# Altium schematic sheet main.SCHDOC
size B
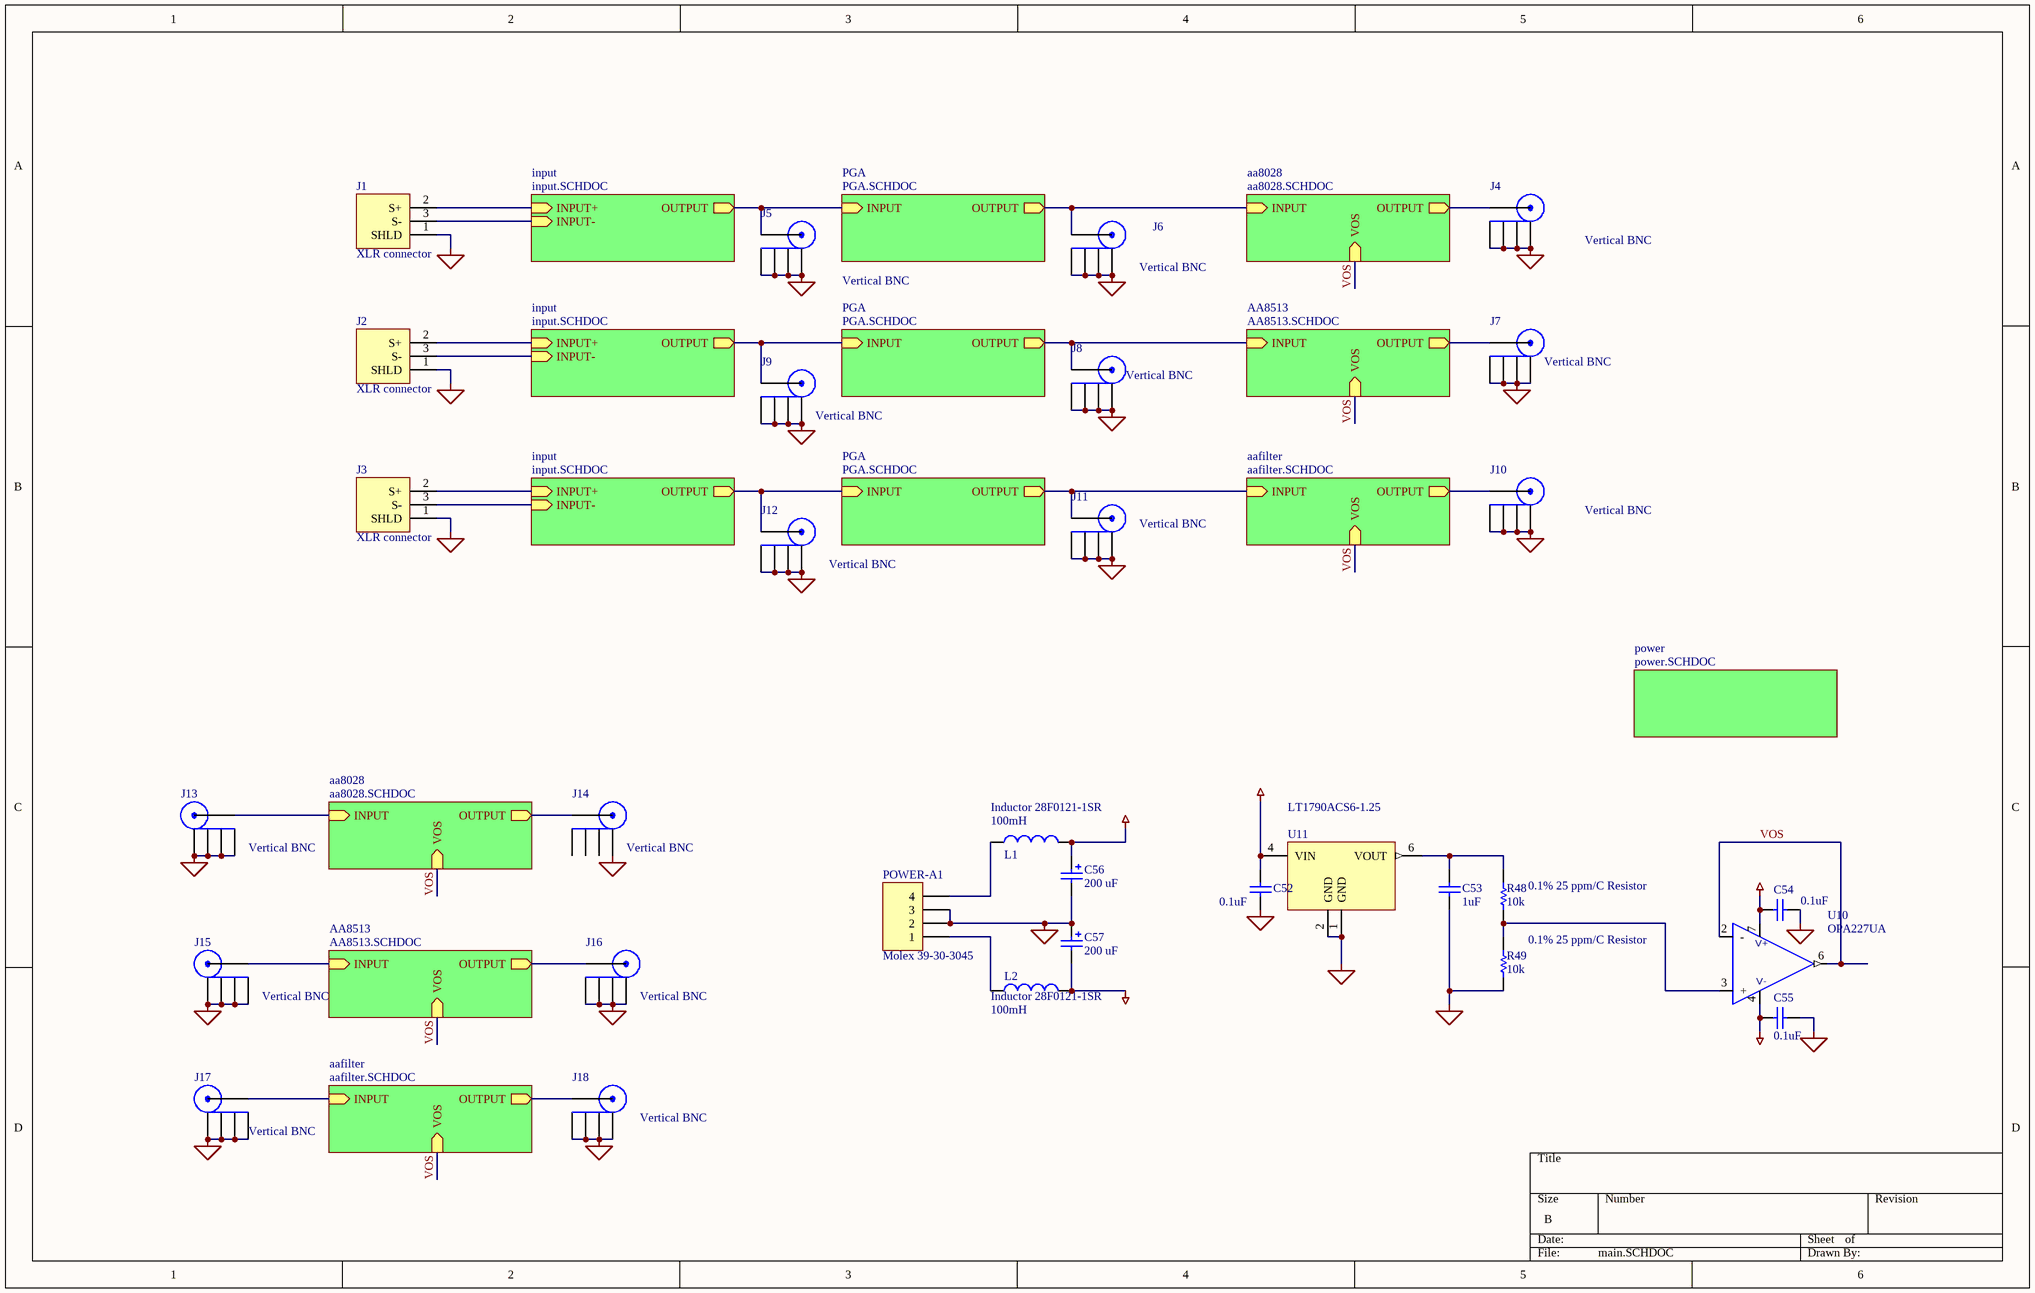
[diagram p0: main.SCHDOC]

## Parts
C52  value 0.1uF  [CC1608-0603]  (hidden comment: Cap)
C53  value 1uF  [CC1608-0603]  (hidden comment: Cap)
C54  value 0.1uF  [CC1608-0603]  (hidden comment: Cap)
C55  value 0.1uF  [CC1608-0603]  (hidden comment: Cap)
C56  value 200 uF  [PanasonicE]
C57  value 200 uF  [PanasonicE]
J1  XLR connector  [NC3FAH-0]
J2  XLR connector  [NC3FAH-0]
J3  XLR connector  [NC3FAH-0]
J4  Vertical BNC  [Vertical BNC 227699-1]
J5  Vertical BNC  [Vertical BNC 227699-1]
J6  Vertical BNC  [Vertical BNC 227699-1]
J7  Vertical BNC  [Vertical BNC 227699-1]
J8  Vertical BNC  [Vertical BNC 227699-1]
J9  Vertical BNC  [Vertical BNC 227699-1]
J10  Vertical BNC  [Vertical BNC 227699-1]
J11  Vertical BNC  [Vertical BNC 227699-1]
J12  Vertical BNC  [Vertical BNC 227699-1]
J13  Vertical BNC  [Vertical BNC 227699-1]
J14  Vertical BNC  [Vertical BNC 227699-1]
J15  Vertical BNC  [Vertical BNC 227699-1]
J16  Vertical BNC  [Vertical BNC 227699-1]
J17  Vertical BNC  [Vertical BNC 227699-1]
J18  Vertical BNC  [Vertical BNC 227699-1]
L1  Inductor 28F0121-1SR  value 100mH  [STEWARD_1SR]
L2  Inductor 28F0121-1SR  value 100mH  [STEWARD_1SR]
POWER-A1  Molex 39-30-3045  [MJ4RTHR]
R48  0.1% 25 ppm/C Resistor  value 10k  [C3216-1206]
R49  0.1% 25 ppm/C Resistor  value 10k  [C3216-1206]
U10  OPA227UA  [SO-G8/D5.1]
U11  LT1790ACS6-1.25  [LTI SOT-23 ThinSOT]

## Sub-sheets
aa8028 = aa8028.SCHDOC: OUTPUT (out), INPUT (in), VOS (in)
aa8028 = aa8028.SCHDOC: OUTPUT (out), INPUT (in), VOS (in)
AA8513 = AA8513.SCHDOC: OUTPUT (out), INPUT (in), VOS (in)
AA8513 = AA8513.SCHDOC: OUTPUT (out), INPUT (in), VOS (in)
aafilter = aafilter.SCHDOC: INPUT (in), VOS (in), OUTPUT (out)
aafilter = aafilter.SCHDOC: INPUT (in), VOS (in), OUTPUT (out)
input = input.SCHDOC: INPUT+ (in), INPUT- (in), OUTPUT (out)
input = input.SCHDOC: INPUT+ (in), INPUT- (in), OUTPUT (out)
input = input.SCHDOC: INPUT+ (in), INPUT- (in), OUTPUT (out)
PGA = PGA.SCHDOC: OUTPUT (out), INPUT (in)
PGA = PGA.SCHDOC: OUTPUT (out), INPUT (in)
PGA = PGA.SCHDOC: OUTPUT (out), INPUT (in)
power = power.SCHDOC: no entries

## Nets
AVDD: C52.1 C54.2 C56.1 L1.2 U10.7(V+) U11.4(VIN)
AVSS: C55.2 C57.2 L2.2 U10.4(V-)
GND: C52.2 C53.2 C54.1 C55.1 C56.2 C57.1 J1.1(SHLD) J2.1(SHLD) J3.1(SHLD) J4.2(SHLD) J4.3(SHLD) J4.4(SHLD) J4.5(SHLD) J5.2(SHLD) J5.3(SHLD) J5.4(SHLD) J5.5(SHLD) J6.2(SHLD) J6.3(SHLD) J6.4(SHLD) J6.5(SHLD) J7.2(SHLD) J7.3(SHLD) J7.4(SHLD) J7.5(SHLD) J8.2(SHLD) J8.3(SHLD) J8.4(SHLD) J8.5(SHLD) J9.2(SHLD) J9.3(SHLD) J9.4(SHLD) J9.5(SHLD) J10.2(SHLD) J10.3(SHLD) J10.4(SHLD) J10.5(SHLD) J11.2(SHLD) J11.3(SHLD) J11.4(SHLD) J11.5(SHLD) J12.2(SHLD) J12.3(SHLD) J12.4(SHLD) J12.5(SHLD) J13.2(SHLD) J13.3(SHLD) J13.4(SHLD) J13.5(SHLD) J14.2(SHLD) J15.2(SHLD) J15.3(SHLD) J15.4(SHLD) J15.5(SHLD) J16.2(SHLD) J16.3(SHLD) J16.4(SHLD) J16.5(SHLD) J17.2(SHLD) J17.3(SHLD) J17.4(SHLD) J17.5(SHLD) J18.2(SHLD) J18.3(SHLD) J18.4(SHLD) J18.5(SHLD) POWER-A1.2 POWER-A1.3 R49.1 U11.1(GND) U11.2(GND)
VOS: U10.2(-) U10.6(Vout) ; sheet aa8028/VOS, sheet AA8513/VOS, sheet aafilter/VOS, sheet aa8028/VOS, sheet AA8513/VOS, sheet aafilter/VOS
NetC53_1: C53.1 R48.2 U11.6(VOUT)
NetJ1_2: J1.2(S+) ; sheet input/INPUT+
NetJ1_3: J1.3(S-) ; sheet input/INPUT-
NetJ2_2: J2.2(S+) ; sheet input/INPUT+
NetJ2_3: J2.3(S-) ; sheet input/INPUT-
NetJ3_2: J3.2(S+) ; sheet input/INPUT+
NetJ3_3: J3.3(S-) ; sheet input/INPUT-
NetJ4_1: J4.1(PIN) ; sheet aa8028/OUTPUT
NetJ5_1: J5.1(PIN) ; sheet input/OUTPUT, sheet PGA/INPUT
NetJ6_1: J6.1(PIN) ; sheet PGA/OUTPUT, sheet aa8028/INPUT
NetJ7_1: J7.1(PIN) ; sheet AA8513/OUTPUT
NetJ8_1: J8.1(PIN) ; sheet PGA/OUTPUT, sheet AA8513/INPUT
NetJ9_1: J9.1(PIN) ; sheet input/OUTPUT, sheet PGA/INPUT
NetJ10_1: J10.1(PIN) ; sheet aafilter/OUTPUT
NetJ11_1: J11.1(PIN) ; sheet aafilter/INPUT, sheet PGA/OUTPUT
NetJ12_1: J12.1(PIN) ; sheet input/OUTPUT, sheet PGA/INPUT
NetJ13_1: J13.1(PIN) ; sheet aa8028/INPUT
NetJ14_1: J14.1(PIN) ; sheet aa8028/OUTPUT
NetJ15_1: J15.1(PIN) ; sheet AA8513/INPUT
NetJ16_1: J16.1(PIN) ; sheet AA8513/OUTPUT
NetJ17_1: J17.1(PIN) ; sheet aafilter/INPUT
NetJ18_1: J18.1(PIN) ; sheet aafilter/OUTPUT
NetL1_1: L1.1 POWER-A1.4
NetL2_1: L2.1 POWER-A1.1
NetR48_1: R48.1 R49.2 U10.3(+)

Not connected (* = marked no-connect by the designer): J14 3(SHLD) 4(SHLD) 5(SHLD)

## Library data of the parts
C52-C55 = Cap: Capacitor; Manufacturer: Generic Components; Class I: Passive; Published: 8-Jun-2000; Revision: July-2002: Re-released for DXP Platform.; Publisher: Altium Limited; Class II: Capacitor
C56 C57 = Cap Pol3: Polarized Capacitor (Surface Mount); Manufacturer: Generic Components; Class I: Passive; Published: 8-Jun-2000; Revision: July-2002: Re-released for DXP Platform.; Publisher: Altium Limited; Class II: Capacitor
J1-J3 = XLR: XLR balanced connector, standard
J4-J18 = VERTBNC: Vertical BNC with correct grounding pin behavior
L1 L2 = Inductor: Manufacturer: Generic Components; Class I: Passive; Published: 8-Jun-2000; Revision: July-2002: Re-released for DXP Platform.; Publisher: Altium Limited; Class II: Inductor
POWER-A1 = Header 4: Header, 4-Pin; Manufacturer: Generic Components; Class I: Connector; Revision: July-2002: Re-released for DXP Platform.; Publisher: Altium Limited
R48 R49 = Res1: Resistor; Manufacturer: Generic Components; Class I: Passive; Published: 8-Jun-2000; Revision: July-2002: Re-released for DXP Platform.; Publisher: Altium Limited; Class II: Resistor
U11 = LT1790